# EAGLE board 26-de-8 (EAGLE 6.6.0), part 1 of 4
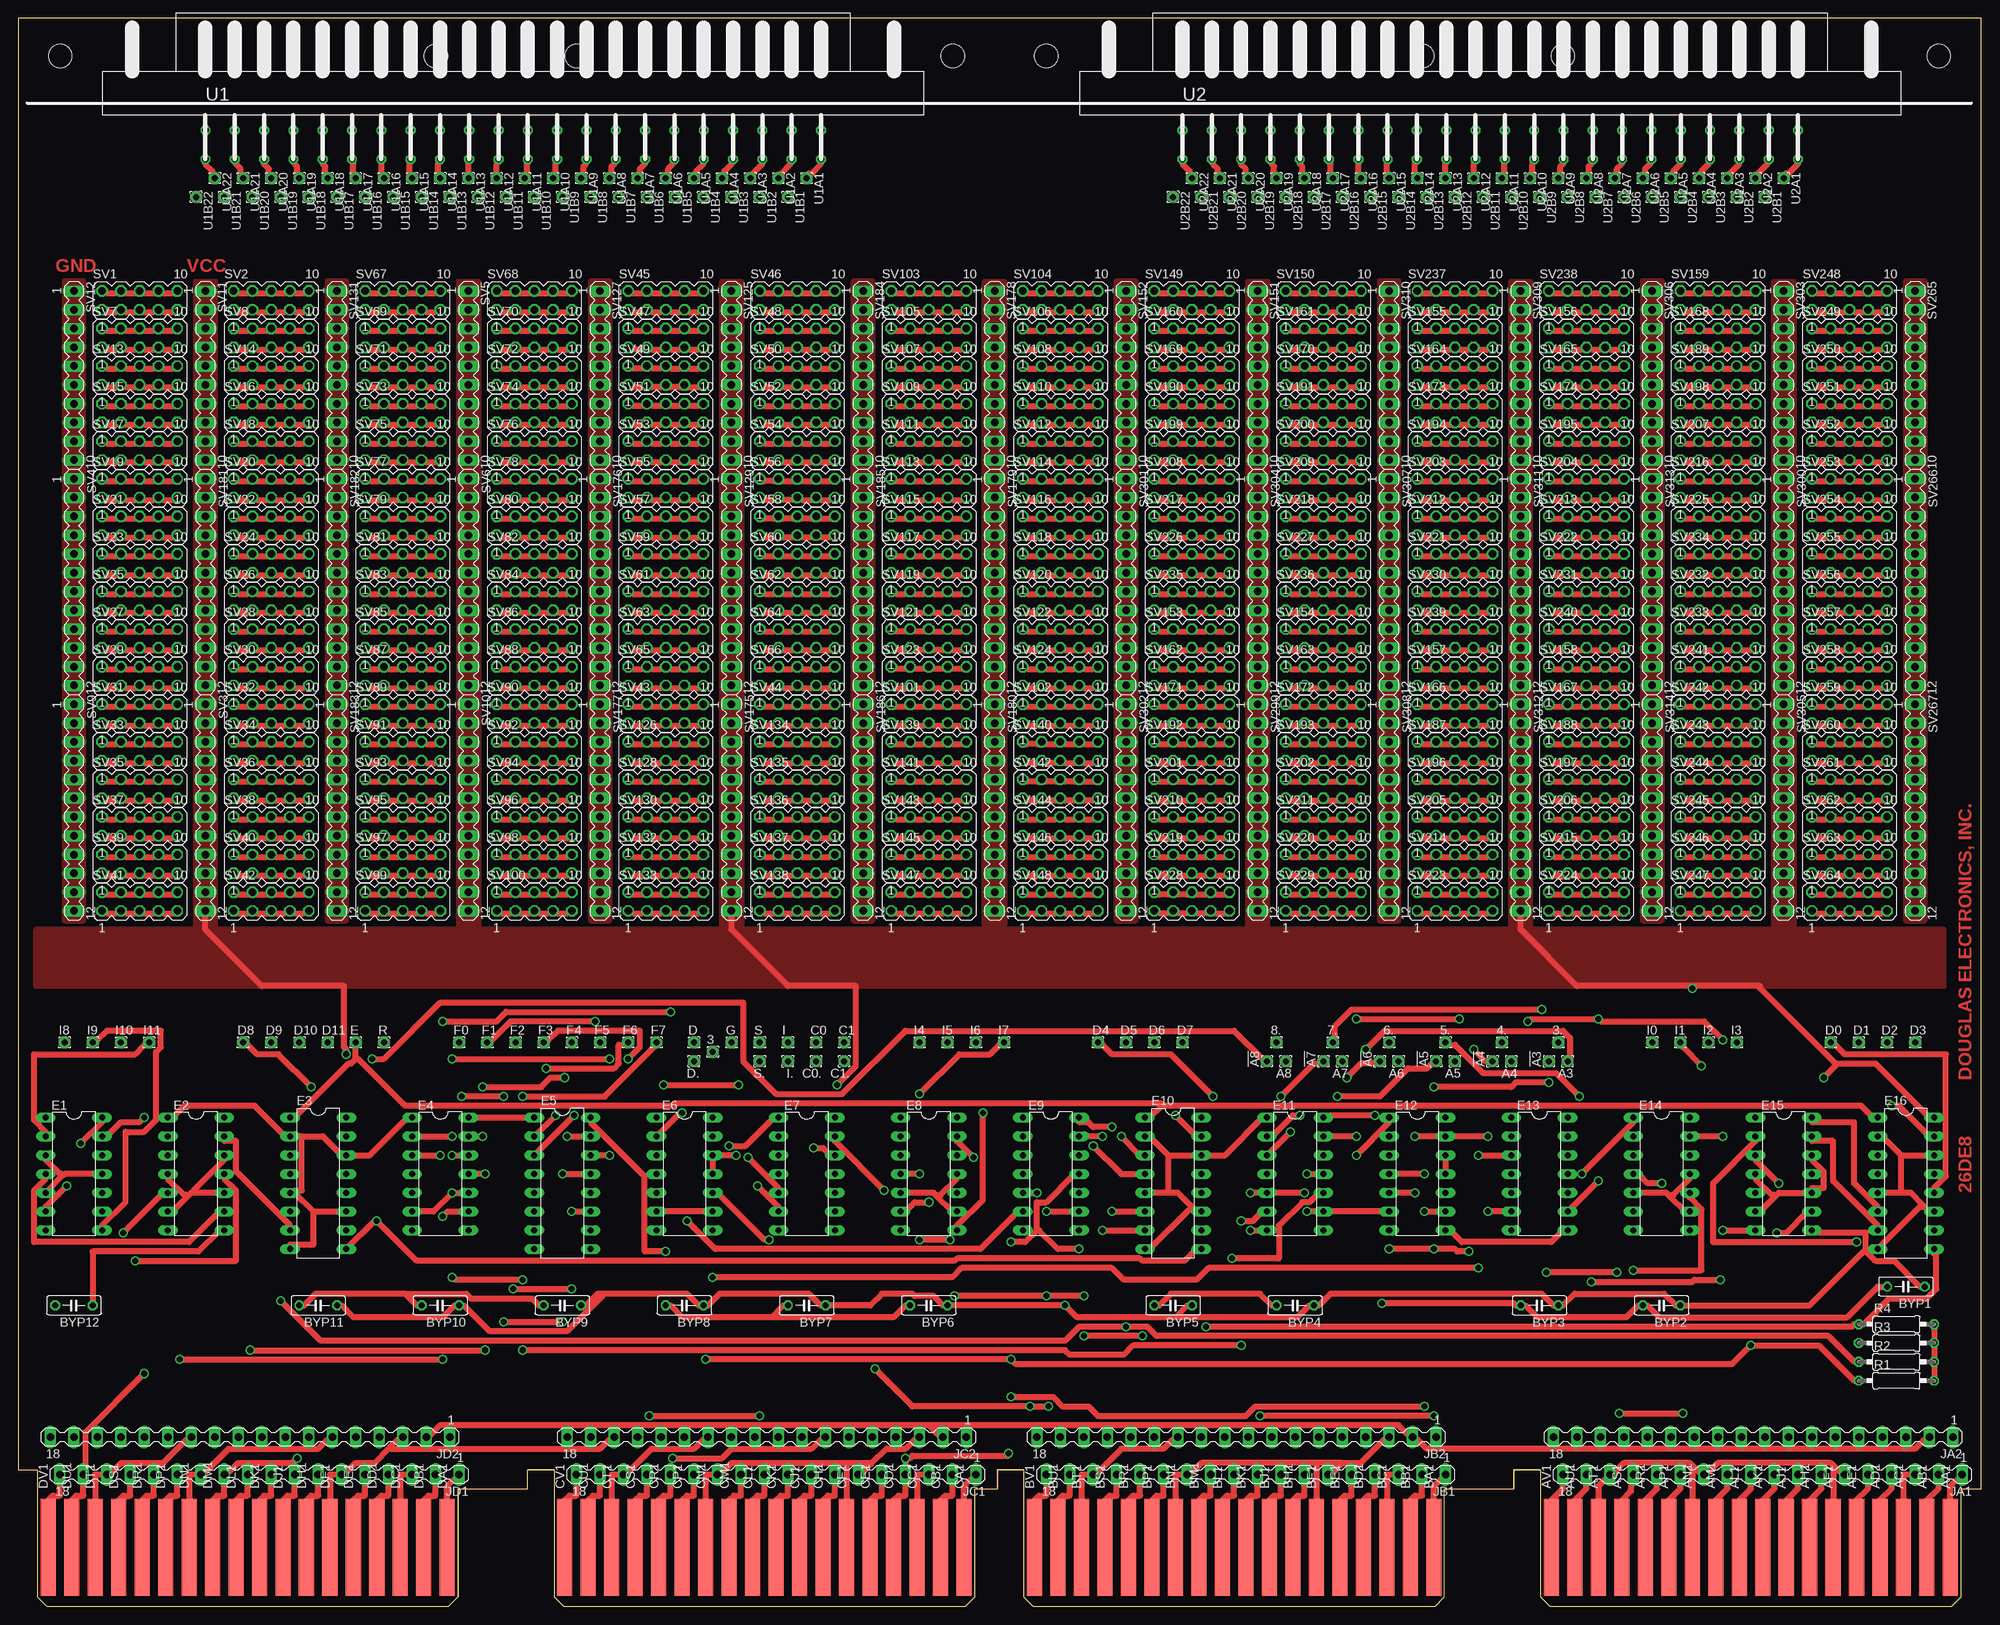
[diagram p4: board, top side]
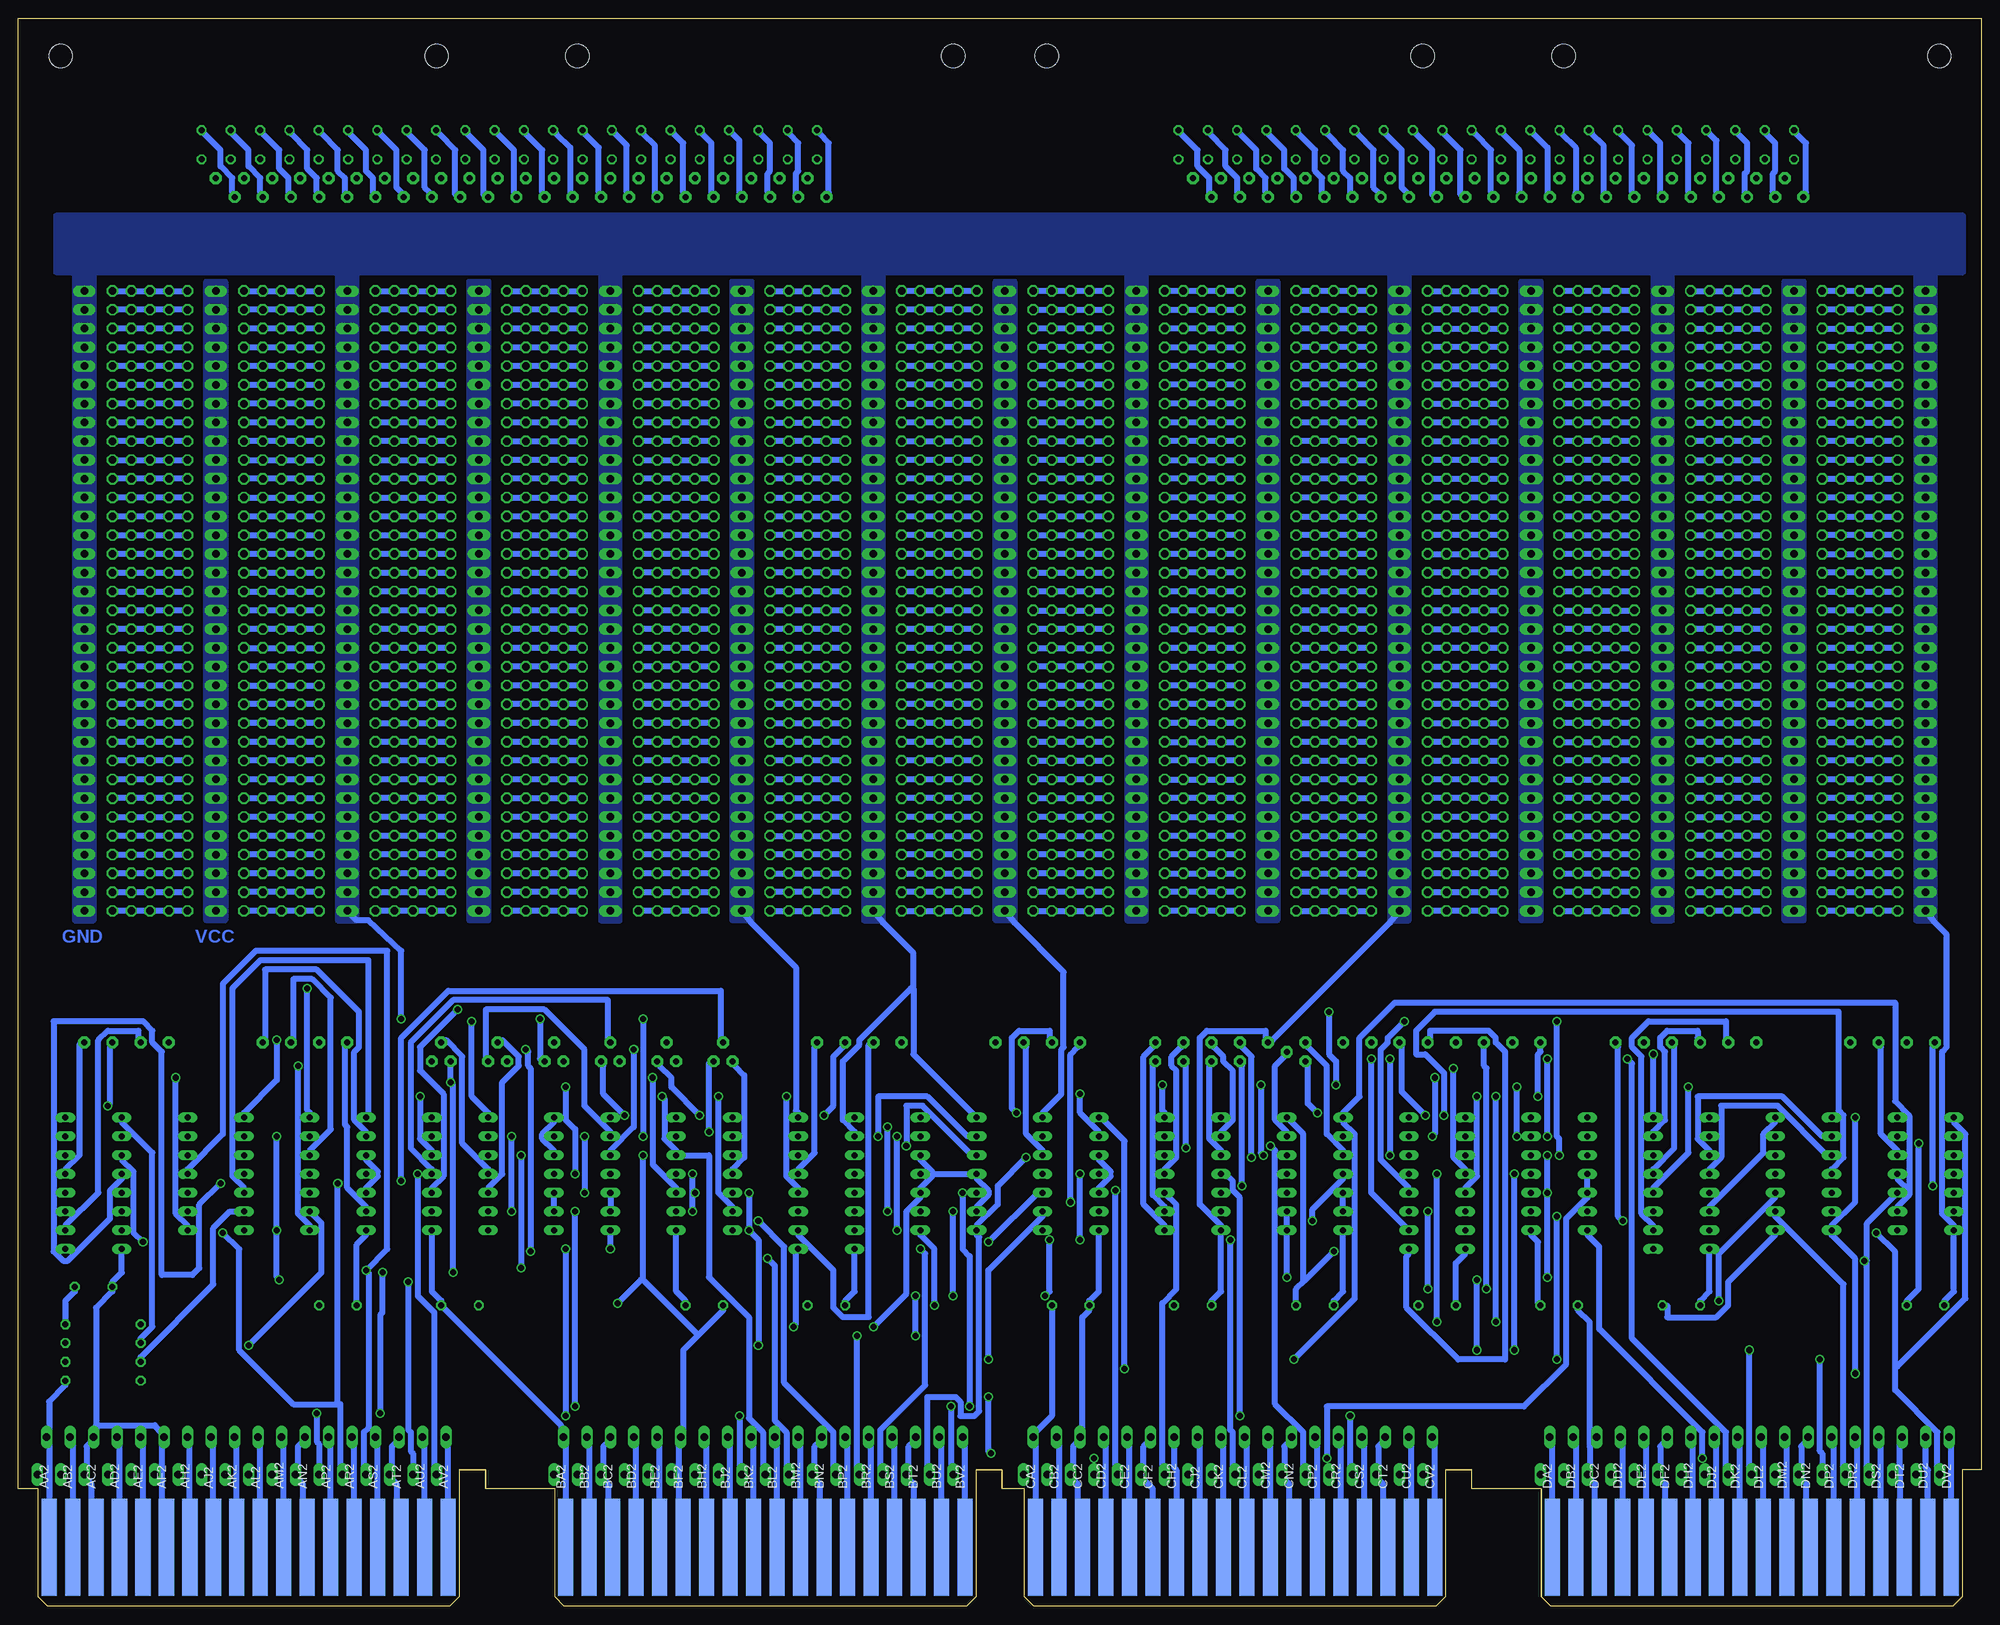
[diagram p5: board, bottom side, seen from below]

Size 265.3 x 214.63 mm. Coordinates in mm from the lower left corner, seen from the top.
Copper layers (1+16): Top 0.035mm / dielectric 1.5mm / Bottom 0.035mm
Design rules "16mils": minimum track width 16mil, minimum drill 32mil, track to track 15mil, track to pad 10mil, pad to pad 10mil, via to via 10mil, smd to smd 10mil, copper to edge 13mil, drill to drill 10mil, minimum pad ring 10mil, minimum via ring 8mil, stop-mask expansion 0mil, vias tented up to drill 0mil, thermal gap 10mil
Net classes: 0 default: width 0.813 mm; 1 supply: width 0.813 mm

## Footprints (pad centres in the part's own frame; a part is rotated, then mirrored left to right if it is on the bottom)
1,6/0,8 = drill 0.813 pad 1.6 octagon: 1 0,0
C050-025X075 = drill 0.813 octagon: 1 -2.54,0; 2 2.54,0
DIL14 = drill 0.813 long: 1 -7.62,-3.81; 2 -5.08,-3.81; 3 -2.54,-3.81; 4 0,-3.81; 5 2.54,-3.81; 6 5.08,-3.81; 7 7.62,-3.81; 8 7.62,3.81; 9 5.08,3.81; 10 2.54,3.81; 11 0,3.81; 12 -2.54,3.81; 13 -5.08,3.81; 14 -7.62,3.81
DIL16 = drill 0.813 long: 1 -8.89,-3.81; 2 -6.35,-3.81; 3 -3.81,-3.81; 4 -1.27,-3.81; 5 1.27,-3.81; 6 3.81,-3.81; 7 6.35,-3.81; 8 8.89,-3.81; 9 8.89,3.81; 10 6.35,3.81; 11 3.81,3.81; 12 1.27,3.81; 13 -1.27,3.81; 14 -3.81,3.81; 15 -6.35,3.81; 16 -8.89,3.81
MA18-1 = drill 1.016 long: 1 -25.4,0; 2 -22.225,0; 3 -19.05,0; 4 -15.875,0; 5 -12.7,0; 6 -9.525,0; 7 -6.35,0; 8 -3.175,0; 9 0,0; 10 3.175,0; 11 6.35,0; 12 9.525,0; 13 12.7,0; 14 15.875,0; 15 19.05,0; 16 22.225,0; 17 25.4,0; 18 28.575,0
0207/10 = drill 0.813 octagon: 1 -5.08,0; 2 5.08,0
MA05-2 = drill 1.016 octagon: 1 -5.08,-1.27; 2 -5.08,1.27; 3 -2.54,-1.27; 4 -2.54,1.27; 5 0,-1.27; 6 0,1.27; 7 2.54,-1.27; 8 2.54,1.27; 9 5.08,-1.27; 10 5.08,1.27
MA12-1 = drill 1.016 long: 1 -13.97,0; 2 -11.43,0; 3 -8.89,0; 4 -6.35,0; 5 -3.81,0; 6 -1.27,0; 7 1.27,0; 8 3.81,0; 9 6.35,0; 10 8.89,0; 11 11.43,0; 12 13.97,0
MA10-1 = drill 1.016 long: 1 -11.43,0; 2 -8.89,0; 3 -6.35,0; 4 -3.81,0; 5 -1.27,0; 6 1.27,0; 7 3.81,0; 8 6.35,0; 9 8.89,0; 10 11.43,0
133-022-03 = drill 0.813 octagon: A1 83.21,0; A2 83.21,3.962; B1 79.248,0; B2 79.248,3.962; C1 75.286,0; C2 75.286,3.962; D1 71.323,0; D2 71.323,3.962; E1 67.361,0; E2 67.361,3.962; F1 63.398,0; F2 63.398,3.962; H1 59.436,0; H2 59.436,3.962; J1 55.474,0; J2 55.474,3.962; K1 51.511,0; K2 51.511,3.962; L1 47.549,0; L2 47.549,3.962; M1 43.586,0; M2 43.586,3.962; N1 39.624,0; N2 39.624,3.962; P1 35.662,0; P2 35.662,3.962; R1 31.699,0; R2 31.699,3.962; S1 27.737,0; S2 27.737,3.962; T1 23.774,0; T2 23.774,3.962; U1 19.812,0; U2 19.812,3.962; V1 15.85,0; V2 15.85,3.962; W1 11.887,0; W2 11.887,3.962; X1 7.925,0; X2 7.925,3.962; Y1 3.962,0; Y2 3.962,3.962; Z1 0,0; Z2 0,3.962
OMNIBUS = hole 3.175: 208.915,209.55; 259.715,209.55; 189.865,209.55; 139.065,209.55; 75.616,209.55; 126.416,209.55; 56.566,209.55; 5.766,209.55
EDGE-CON8 = smd 2.032 x 13.106: AA1 261.303,7.938; AB1 258.127,7.938; AC1 254.952,7.938; AD1 251.778,7.938; AE1 248.602,7.938; AF1 245.428,7.938; AH1 242.252,7.938; AJ1 239.077,7.938; AK1 235.903,7.938; AL1 232.727,7.938; AM1 229.553,7.938; AN1 226.377,7.938; AP1 223.202,7.938; AR1 220.028,7.938; AS1 216.852,7.938; AT1 213.678,7.938; AU1 210.502,7.938; AV1 207.327,7.938; BA1 191.452,7.938; BB1 188.278,7.938; BC1 185.102,7.938; BD1 181.928,7.938; BE1 178.752,7.938; BF1 175.577,7.938; BH1 172.403,7.938; BJ1 169.227,7.938; BK1 166.053,7.938; BL1 162.877,7.938; BM1 159.702,7.938; BN1 156.528,7.938; BP1 153.352,7.938; BR1 150.178,7.938; BS1 147.002,7.938; BT1 143.827,7.938; BU1 140.653,7.938; BV1 137.477,7.938; CA1 127.953,7.938; CB1 124.778,7.938; CC1 121.603,7.938; CD1 118.427,7.938; CE1 115.252,7.938; CF1 112.078,7.938; CH1 108.903,7.938; CJ1 105.728,7.938; CK1 102.552,7.938; CL1 99.377,7.938; CM1 96.203,7.938; CN1 93.028,7.938; CP1 89.853,7.938; CR1 86.677,7.938; CS1 83.502,7.938; CT1 80.328,7.938; CU1 77.153,7.938; CV1 73.978,7.938; DA1 58.102,7.938; DB1 54.928,7.938; DC1 51.752,7.938; DD1 48.578,7.938; DE1 45.403,7.938; DF1 42.227,7.938; DH1 39.053,7.938; DJ1 35.877,7.938; DK1 32.703,7.938; DL1 29.527,7.938; DM1 26.352,7.938; DN1 23.177,7.938; DP1 20.003,7.938; DR1 16.828,7.938; DS1 13.652,7.938; DT1 10.477,7.938; DU1 7.303,7.938; DV1 4.128,7.938 | smd 2.032 x 13.106 bottom: AA2 261.303,7.938; AB2 258.127,7.938; AC2 254.952,7.938; AD2 251.778,7.938; AE2 248.602,7.938; AF2 245.428,7.938; AH2 242.252,7.938; AJ2 239.077,7.938; AK2 235.903,7.938; AL2 232.727,7.938; AM2 229.553,7.938; AN2 226.377,7.938; AP2 223.202,7.938; AR2 220.028,7.938; AS2 216.852,7.938; AT2 213.678,7.938; AU2 210.502,7.938; AV2 207.327,7.938; BA2 191.452,7.938; BB2 188.278,7.938; BC2 185.102,7.938; BD2 181.928,7.938; BE2 178.752,7.938; BF2 175.577,7.938; BH2 172.403,7.938; BJ2 169.227,7.938; BK2 166.053,7.938; BL2 162.877,7.938; BM2 159.702,7.938; BN2 156.528,7.938; BP2 153.352,7.938; BR2 150.178,7.938; BS2 147.002,7.938; BT2 143.827,7.938; BU2 140.653,7.938; BV2 137.477,7.938; CA2 127.953,7.938; CB2 124.778,7.938; CC2 121.603,7.938; CD2 118.427,7.938; CE2 115.252,7.938; CF2 112.078,7.938; CH2 108.903,7.938; CJ2 105.728,7.938; CK2 102.552,7.938; CL2 99.377,7.938; CM2 96.203,7.938; CN2 93.028,7.938; CP2 89.853,7.938; CR2 86.677,7.938; CS2 83.502,7.938; CT2 80.328,7.938; CU2 77.153,7.938; CV2 73.978,7.938; DA2 58.102,7.938; DB2 54.928,7.938; DC2 51.752,7.938; DD2 48.578,7.938; DE2 45.403,7.938; DF2 42.227,7.938; DH2 39.053,7.938; DJ2 35.877,7.938; DK2 32.703,7.938; DL2 29.527,7.938; DM2 26.352,7.938; DN2 23.177,7.938; DP2 20.003,7.938; DR2 16.828,7.938; DS2 13.652,7.938; DT2 10.477,7.938; DU2 7.303,7.938; DV2 4.128,7.938

## Placement (x,y rotation side)
3  [1,6/0,8]  93.85,74.93 0 top
3.  [1,6/0,8]  208.15,76.2 0 top
4.  [1,6/0,8]  200.53,76.2 0 top
5.  [1,6/0,8]  192.91,76.2 0 top
6.  [1,6/0,8]  185.29,76.2 0 top
7.  [1,6/0,8]  177.67,76.2 0 top
8.  [1,6/0,8]  170.05,76.2 0 top
!A3  [1,6/0,8]  206.88,73.66 90 top
!A4  [1,6/0,8]  199.26,73.66 90 top
!A5  [1,6/0,8]  191.64,73.66 90 top
!A6  [1,6/0,8]  184.02,73.66 90 top
!A7  [1,6/0,8]  176.4,73.66 90 top
!A8  [1,6/0,8]  168.78,73.66 90 top
A3  [1,6/0,8]  209.42,73.66 180 top
A4  [1,6/0,8]  201.8,73.66 180 top
A5  [1,6/0,8]  194.18,73.66 180 top
A6  [1,6/0,8]  186.56,73.66 180 top
A7  [1,6/0,8]  178.94,73.66 180 top
A8  [1,6/0,8]  171.32,73.66 180 top
BYP1  0.1uF  [C050-025X075]  255.14,43.18 180 top
BYP2  0.1uF  [C050-025X075]  222.12,40.64 180 top
BYP3  0.1uF  [C050-025X075]  205.61,40.64 180 top
BYP4  0.1uF  [C050-025X075]  172.59,40.64 180 top
BYP5  0.1uF  [C050-025X075]  156.08,40.64 180 top
BYP6  0.1uF  [C050-025X075]  123.06,40.64 180 top
BYP7  0.1uF  [C050-025X075]  106.55,40.64 180 top
BYP8  0.1uF  [C050-025X075]  90.04,40.64 180 top
BYP9  0.1uF  [C050-025X075]  73.53,40.64 180 top
BYP10  0.1uF  [C050-025X075]  57.02,40.64 180 top
BYP11  0.1uF  [C050-025X075]  40.51,40.64 180 top
BYP12  0.1uF  [C050-025X075]  7.49,40.64 180 top
C0  [1,6/0,8]  107.82,76.2 0 top
C0.  [1,6/0,8]  107.82,73.66 180 top
C1  [1,6/0,8]  111.63,76.2 0 top
C1.  [1,6/0,8]  111.63,73.66 180 top
D  [1,6/0,8]  91.31,76.2 0 top
D0  [1,6/0,8]  244.98,76.2 0 top
D1  [1,6/0,8]  248.79,76.2 0 top
D2  [1,6/0,8]  252.6,76.2 0 top
D3  [1,6/0,8]  256.41,76.2 0 top
D4  [1,6/0,8]  145.92,76.2 0 top
D5  [1,6/0,8]  149.73,76.2 0 top
D6  [1,6/0,8]  153.54,76.2 0 top
D7  [1,6/0,8]  157.35,76.2 0 top
D8  [1,6/0,8]  30.35,76.2 0 top
D9  [1,6/0,8]  34.16,76.2 0 top
D10  [1,6/0,8]  37.97,76.2 0 top
D11  [1,6/0,8]  41.78,76.2 0 top
D.  [1,6/0,8]  91.31,73.66 180 top
E  [1,6/0,8]  45.59,76.2 0 top
E1  N8881N  [DIL14]  7.49,58.42 270 top
E2  SP380N  [DIL14]  24,58.42 270 top
E3  DM9314  [DIL16]  40.51,57.15 270 top
E4  SP380N  [DIL14]  57.02,58.42 270 top
E5  DEC8251  [DIL16]  73.53,57.15 270 top
E6  N8881N  [DIL14]  90.04,58.42 270 top
E7  N8881N  [DIL14]  106.55,58.42 270 top
E8  N8881N  [DIL14]  123.06,58.42 270 top
E9  SP380N  [DIL14]  139.57,58.42 270 top
E10  DM9314  [DIL16]  156.08,57.15 270 top
E11  SP380N  [DIL14]  172.59,58.42 270 top
E12  SP380N  [DIL14]  189.1,58.42 270 top
E13  SP314N  [DIL14]  205.61,58.42 270 top
E14  N8881N  [DIL14]  222.12,58.42 270 top
E15  SP380N  [DIL14]  238.63,58.42 270 top
E16  DM9314  [DIL16]  255.14,57.15 270 top
F0  [1,6/0,8]  59.56,76.2 0 top
F1  [1,6/0,8]  63.37,76.2 0 top
F2  [1,6/0,8]  67.18,76.2 0 top
F3  [1,6/0,8]  70.99,76.2 0 top
F4  [1,6/0,8]  74.8,76.2 0 top
F5  [1,6/0,8]  78.61,76.2 0 top
F6  [1,6/0,8]  82.42,76.2 0 top
F7  [1,6/0,8]  86.23,76.2 0 top
G  [1,6/0,8]  96.39,76.2 0 top
I  [1,6/0,8]  104.01,76.2 0 top
I0  [1,6/0,8]  220.85,76.2 0 top
I1  [1,6/0,8]  224.66,76.2 0 top
I2  [1,6/0,8]  228.47,76.2 0 top
I3  [1,6/0,8]  232.28,76.2 0 top
I4  [1,6/0,8]  121.79,76.2 0 top
I5  [1,6/0,8]  125.6,76.2 0 top
I6  [1,6/0,8]  129.41,76.2 0 top
I7  [1,6/0,8]  133.22,76.2 0 top
I8  [1,6/0,8]  6.22,76.2 0 top
I9  [1,6/0,8]  10.03,76.2 0 top
I10  [1,6/0,8]  13.84,76.2 0 top
I11  [1,6/0,8]  17.65,76.2 0 top
I.  [1,6/0,8]  104.01,73.66 180 top
JA1  MA18-1  [MA18-1]  237.36,17.78 180 top
JA2  MA18-1  [MA18-1]  236.09,22.86 180 top
JB1  MA18-1  [MA18-1]  167.51,17.78 180 top
JB2  MA18-1  [MA18-1]  166.24,22.86 180 top
JC1  MA18-1  [MA18-1]  104.01,17.78 180 top
JC2  MA18-1  [MA18-1]  102.74,22.86 180 top
JD1  MA18-1  [MA18-1]  34.16,17.78 180 top
JD2  MA18-1  [MA18-1]  32.89,22.86 180 top
R  [1,6/0,8]  49.4,76.2 0 top
R1  [0207/10]  253.87,30.48 0 top
R2  [0207/10]  253.87,33.02 0 top
R3  [0207/10]  253.87,35.56 0 top
R4  [0207/10]  253.87,38.1 0 top
S  [1,6/0,8]  100.2,76.2 0 top
S.  [1,6/0,8]  100.2,73.66 180 top
SV1  [MA05-2]  16.38,176.53 0 top
SV2  [MA05-2]  34.16,176.53 0 top
SV3  [MA12-1]  25.27,107.95 270 top
SV4  [MA12-1]  7.49,138.43 270 top
SV5  [MA10-1]  60.83,166.37 270 top
SV6  [MA12-1]  60.83,138.43 270 top
SV7  [MA05-2]  16.38,171.45 0 top
SV8  [MA05-2]  34.16,171.45 0 top
SV9  [MA12-1]  7.49,107.95 270 top
SV10  [MA12-1]  60.83,107.95 270 top
SV11  [MA10-1]  25.27,166.37 270 top
SV12  [MA10-1]  7.49,166.37 270 top
SV13  [MA05-2]  16.38,166.37 0 top
SV14  [MA05-2]  34.16,166.37 0 top
SV15  [MA05-2]  16.38,161.29 0 top
SV16  [MA05-2]  34.16,161.29 0 top
SV17  [MA05-2]  16.38,156.21 0 top
SV18  [MA05-2]  34.16,156.21 0 top
SV19  [MA05-2]  16.38,151.13 0 top
SV20  [MA05-2]  34.16,151.13 0 top
SV21  [MA05-2]  16.38,146.05 0 top
SV22  [MA05-2]  34.16,146.05 0 top
SV23  [MA05-2]  16.38,140.97 0 top
SV24  [MA05-2]  34.16,140.97 0 top
SV25  [MA05-2]  16.38,135.89 0 top
SV26  [MA05-2]  34.16,135.89 0 top
SV27  [MA05-2]  16.38,130.81 0 top
SV28  [MA05-2]  34.16,130.81 0 top
SV29  [MA05-2]  16.38,125.73 0 top
SV30  [MA05-2]  34.16,125.73 0 top
SV31  [MA05-2]  16.38,120.65 0 top
SV32  [MA05-2]  34.16,120.65 0 top
SV33  [MA05-2]  16.38,115.57 0 top
SV34  [MA05-2]  34.16,115.57 0 top
SV35  [MA05-2]  16.38,110.49 0 top
SV36  [MA05-2]  34.16,110.49 0 top
SV37  [MA05-2]  16.38,105.41 0 top
SV38  [MA05-2]  34.16,105.41 0 top
SV39  [MA05-2]  16.38,100.33 0 top
SV40  [MA05-2]  34.16,100.33 0 top
SV41  [MA05-2]  16.38,95.25 0 top
SV42  [MA05-2]  34.16,95.25 0 top
SV43  [MA05-2]  87.5,120.65 0 top
SV44  [MA05-2]  105.28,120.65 0 top
SV45  [MA05-2]  87.5,176.53 0 top
SV46  [MA05-2]  105.28,176.53 0 top
SV47  [MA05-2]  87.5,171.45 0 top
SV48  [MA05-2]  105.28,171.45 0 top
SV49  [MA05-2]  87.5,166.37 0 top
SV50  [MA05-2]  105.28,166.37 0 top
SV51  [MA05-2]  87.5,161.29 0 top
SV52  [MA05-2]  105.28,161.29 0 top
SV53  [MA05-2]  87.5,156.21 0 top
SV54  [MA05-2]  105.28,156.21 0 top
SV55  [MA05-2]  87.5,151.13 0 top
SV56  [MA05-2]  105.28,151.13 0 top
SV57  [MA05-2]  87.5,146.05 0 top
SV58  [MA05-2]  105.28,146.05 0 top
SV59  [MA05-2]  87.5,140.97 0 top
SV60  [MA05-2]  105.28,140.97 0 top
SV61  [MA05-2]  87.5,135.89 0 top
SV62  [MA05-2]  105.28,135.89 0 top
SV63  [MA05-2]  87.5,130.81 0 top
SV64  [MA05-2]  105.28,130.81 0 top
SV65  [MA05-2]  87.5,125.73 0 top
SV66  [MA05-2]  105.28,125.73 0 top
SV67  [MA05-2]  51.94,176.53 0 top
SV68  [MA05-2]  69.72,176.53 0 top
SV69  [MA05-2]  51.94,171.45 0 top
SV70  [MA05-2]  69.72,171.45 0 top
SV71  [MA05-2]  51.94,166.37 0 top
SV72  [MA05-2]  69.72,166.37 0 top
SV73  [MA05-2]  51.94,161.29 0 top
SV74  [MA05-2]  69.72,161.29 0 top
SV75  [MA05-2]  51.94,156.21 0 top
SV76  [MA05-2]  69.72,156.21 0 top
SV77  [MA05-2]  51.94,151.13 0 top
SV78  [MA05-2]  69.72,151.13 0 top
SV79  [MA05-2]  51.94,146.05 0 top
SV80  [MA05-2]  69.72,146.05 0 top
SV81  [MA05-2]  51.94,140.97 0 top
SV82  [MA05-2]  69.72,140.97 0 top
SV83  [MA05-2]  51.94,135.89 0 top
SV84  [MA05-2]  69.72,135.89 0 top
SV85  [MA05-2]  51.94,130.81 0 top
SV86  [MA05-2]  69.72,130.81 0 top
SV87  [MA05-2]  51.94,125.73 0 top
SV88  [MA05-2]  69.72,125.73 0 top
SV89  [MA05-2]  51.94,120.65 0 top
SV90  [MA05-2]  69.72,120.65 0 top
SV91  [MA05-2]  51.94,115.57 0 top
SV92  [MA05-2]  69.72,115.57 0 top
SV93  [MA05-2]  51.94,110.49 0 top
SV94  [MA05-2]  69.72,110.49 0 top
SV95  [MA05-2]  51.94,105.41 0 top
SV96  [MA05-2]  69.72,105.41 0 top
SV97  [MA05-2]  51.94,100.33 0 top
SV98  [MA05-2]  69.72,100.33 0 top
SV99  [MA05-2]  51.94,95.25 0 top
SV100  [MA05-2]  69.72,95.25 0 top
SV101  [MA05-2]  123.06,120.65 0 top
SV102  [MA05-2]  140.84,120.65 0 top
SV103  [MA05-2]  123.06,176.53 0 top
SV104  [MA05-2]  140.84,176.53 0 top
SV105  [MA05-2]  123.06,171.45 0 top
SV106  [MA05-2]  140.84,171.45 0 top
SV107  [MA05-2]  123.06,166.37 0 top
SV108  [MA05-2]  140.84,166.37 0 top
SV109  [MA05-2]  123.06,161.29 0 top
SV110  [MA05-2]  140.84,161.29 0 top
SV111  [MA05-2]  123.06,156.21 0 top
SV112  [MA05-2]  140.84,156.21 0 top
SV113  [MA05-2]  123.06,151.13 0 top
SV114  [MA05-2]  140.84,151.13 0 top
SV115  [MA05-2]  123.06,146.05 0 top
SV116  [MA05-2]  140.84,146.05 0 top
SV117  [MA05-2]  123.06,140.97 0 top
SV118  [MA05-2]  140.84,140.97 0 top
SV119  [MA05-2]  123.06,135.89 0 top
SV120  [MA05-2]  140.84,135.89 0 top
SV121  [MA05-2]  123.06,130.81 0 top
SV122  [MA05-2]  140.84,130.81 0 top
SV123  [MA05-2]  123.06,125.73 0 top
SV124  [MA05-2]  140.84,125.73 0 top
SV125  [MA10-1]  96.39,166.37 270 top
SV126  [MA05-2]  87.5,115.57 0 top
SV127  [MA10-1]  78.61,166.37 270 top
SV128  [MA05-2]  87.5,110.49 0 top
SV129  [MA12-1]  96.39,138.43 270 top
SV130  [MA05-2]  87.5,105.41 0 top
SV131  [MA10-1]  43.05,166.37 270 top
SV132  [MA05-2]  87.5,100.33 0 top
SV133  [MA05-2]  87.5,95.25 0 top
SV134  [MA05-2]  105.28,115.57 0 top
SV135  [MA05-2]  105.28,110.49 0 top
SV136  [MA05-2]  105.28,105.41 0 top
SV137  [MA05-2]  105.28,100.33 0 top
SV138  [MA05-2]  105.28,95.25 0 top
SV139  [MA05-2]  123.06,115.57 0 top
SV140  [MA05-2]  140.84,115.57 0 top
SV141  [MA05-2]  123.06,110.49 0 top
SV142  [MA05-2]  140.84,110.49 0 top
SV143  [MA05-2]  123.06,105.41 0 top
SV144  [MA05-2]  140.84,105.41 0 top
SV145  [MA05-2]  123.06,100.33 0 top
SV146  [MA05-2]  140.84,100.33 0 top
SV147  [MA05-2]  123.06,95.25 0 top
SV148  [MA05-2]  140.84,95.25 0 top
SV149  [MA05-2]  158.62,176.53 0 top
SV150  [MA05-2]  176.4,176.53 0 top
SV151  [MA10-1]  167.51,166.37 270 top
SV152  [MA10-1]  149.73,166.37 270 top
SV153  [MA05-2]  158.62,130.81 0 top
SV154  [MA05-2]  176.4,130.81 0 top
SV155  [MA05-2]  194.18,171.45 0 top
SV156  [MA05-2]  211.96,171.45 0 top
SV157  [MA05-2]  194.18,125.73 0 top
SV158  [MA05-2]  211.96,125.73 0 top
SV159  [MA05-2]  229.74,176.53 0 top
SV160  [MA05-2]  158.62,171.45 0 top
SV161  [MA05-2]  176.4,171.45 0 top
SV162  [MA05-2]  158.62,125.73 0 top
SV163  [MA05-2]  176.4,125.73 0 top
SV164  [MA05-2]  194.18,166.37 0 top
SV165  [MA05-2]  211.96,166.37 0 top
SV166  [MA05-2]  194.18,120.65 0 top
SV167  [MA05-2]  211.96,120.65 0 top
SV168  [MA05-2]  229.74,171.45 0 top
SV169  [MA05-2]  158.62,166.37 0 top
SV170  [MA05-2]  176.4,166.37 0 top
SV171  [MA05-2]  158.62,120.65 0 top
SV172  [MA05-2]  176.4,120.65 0 top
SV173  [MA05-2]  194.18,161.29 0 top
SV174  [MA05-2]  211.96,161.29 0 top
SV175  [MA12-1]  96.39,107.95 270 top
SV176  [MA12-1]  78.61,138.43 270 top
SV177  [MA12-1]  78.61,107.95 270 top
SV178  [MA10-1]  131.95,166.37 270 top
SV179  [MA12-1]  131.95,138.43 270 top
SV180  [MA12-1]  131.95,107.95 270 top
SV181  [MA12-1]  25.27,138.43 270 top
SV182  [MA12-1]  43.05,138.43 270 top
SV183  [MA12-1]  43.05,107.95 270 top
SV184  [MA10-1]  114.17,166.37 270 top
SV185  [MA12-1]  114.17,138.43 270 top
SV186  [MA12-1]  114.17,107.95 270 top
SV187  [MA05-2]  194.18,115.57 0 top
SV188  [MA05-2]  211.96,115.57 0 top
SV189  [MA05-2]  229.74,166.37 0 top
SV190  [MA05-2]  158.62,161.29 0 top
SV191  [MA05-2]  176.4,161.29 0 top
SV192  [MA05-2]  158.62,115.57 0 top
SV193  [MA05-2]  176.4,115.57 0 top
SV194  [MA05-2]  194.18,156.21 0 top
SV195  [MA05-2]  211.96,156.21 0 top
SV196  [MA05-2]  194.18,110.49 0 top
SV197  [MA05-2]  211.96,110.49 0 top
SV198  [MA05-2]  229.74,161.29 0 top
SV199  [MA05-2]  158.62,156.21 0 top
SV200  [MA05-2]  176.4,156.21 0 top
SV201  [MA05-2]  158.62,110.49 0 top
SV202  [MA05-2]  176.4,110.49 0 top
SV203  [MA05-2]  194.18,151.13 0 top
SV204  [MA05-2]  211.96,151.13 0 top
SV205  [MA05-2]  194.18,105.41 0 top
SV206  [MA05-2]  211.96,105.41 0 top
SV207  [MA05-2]  229.74,156.21 0 top
SV208  [MA05-2]  158.62,151.13 0 top
SV209  [MA05-2]  176.4,151.13 0 top
SV210  [MA05-2]  158.62,105.41 0 top
SV211  [MA05-2]  176.4,105.41 0 top
SV212  [MA05-2]  194.18,146.05 0 top
SV213  [MA05-2]  211.96,146.05 0 top
SV214  [MA05-2]  194.18,100.33 0 top
SV215  [MA05-2]  211.96,100.33 0 top
SV216  [MA05-2]  229.74,151.13 0 top
SV217  [MA05-2]  158.62,146.05 0 top
SV218  [MA05-2]  176.4,146.05 0 top
SV219  [MA05-2]  158.62,100.33 0 top
SV220  [MA05-2]  176.4,100.33 0 top
SV221  [MA05-2]  194.18,140.97 0 top
SV222  [MA05-2]  211.96,140.97 0 top
SV223  [MA05-2]  194.18,95.25 0 top
SV224  [MA05-2]  211.96,95.25 0 top
SV225  [MA05-2]  229.74,146.05 0 top
SV226  [MA05-2]  158.62,140.97 0 top
SV227  [MA05-2]  176.4,140.97 0 top
SV228  [MA05-2]  158.62,95.25 0 top
SV229  [MA05-2]  176.4,95.25 0 top
SV230  [MA05-2]  194.18,135.89 0 top
SV231  [MA05-2]  211.96,135.89 0 top
SV232  [MA05-2]  229.74,135.89 0 top
SV233  [MA05-2]  229.74,130.81 0 top
SV234  [MA05-2]  229.74,140.97 0 top
SV235  [MA05-2]  158.62,135.89 0 top
SV236  [MA05-2]  176.4,135.89 0 top
SV237  [MA05-2]  194.18,176.53 0 top
SV238  [MA05-2]  211.96,176.53 0 top
SV239  [MA05-2]  194.18,130.81 0 top
SV240  [MA05-2]  211.96,130.81 0 top
SV241  [MA05-2]  229.74,125.73 0 top
SV242  [MA05-2]  229.74,120.65 0 top
SV243  [MA05-2]  229.74,115.57 0 top
SV244  [MA05-2]  229.74,110.49 0 top
SV245  [MA05-2]  229.74,105.41 0 top
SV246  [MA05-2]  229.74,100.33 0 top
SV247  [MA05-2]  229.74,95.25 0 top
SV248  [MA05-2]  247.52,176.53 0 top
SV249  [MA05-2]  247.52,171.45 0 top
SV250  [MA05-2]  247.52,166.37 0 top
SV251  [MA05-2]  247.52,161.29 0 top
SV252  [MA05-2]  247.52,156.21 0 top
SV253  [MA05-2]  247.52,151.13 0 top
SV254  [MA05-2]  247.52,146.05 0 top
SV255  [MA05-2]  247.52,140.97 0 top
SV256  [MA05-2]  247.52,135.89 0 top
SV257  [MA05-2]  247.52,130.81 0 top
SV258  [MA05-2]  247.52,125.73 0 top
SV259  [MA05-2]  247.52,120.65 0 top
SV260  [MA05-2]  247.52,115.57 0 top
SV261  [MA05-2]  247.52,110.49 0 top
SV262  [MA05-2]  247.52,105.41 0 top
SV263  [MA05-2]  247.52,100.33 0 top
SV264  [MA05-2]  247.52,95.25 0 top
SV265  [MA10-1]  256.41,166.37 270 top
SV266  [MA12-1]  256.41,138.43 270 top
SV267  [MA12-1]  256.41,107.95 270 top
SV299  [MA12-1]  167.51,107.95 270 top
SV300  [MA12-1]  238.63,138.43 270 top
SV301  [MA12-1]  149.73,138.43 270 top
SV302  [MA12-1]  149.73,107.95 270 top
SV303  [MA10-1]  238.63,166.37 270 top
SV304  [MA12-1]  167.51,138.43 270 top
SV305  [MA12-1]  238.63,107.95 270 top
SV306  [MA10-1]  220.85,166.37 270 top
SV307  [MA12-1]  185.29,138.43 270 top
SV308  [MA12-1]  185.29,107.95 270 top
SV309  [MA10-1]  203.07,166.37 270 top
SV310  [MA10-1]  185.29,166.37 270 top
SV311  [MA12-1]  203.07,138.43 270 top
SV312  [MA12-1]  203.07,107.95 270 top
SV313  [MA12-1]  220.85,138.43 270 top
SV314  [MA12-1]  220.85,107.95 270 top
U1  133-022-03  [133-022-03]  25.27,195.58 0 top
U1A1  [1,6/0,8]  106.55,193.04 270 top
U1A2  [1,6/0,8]  102.74,193.04 270 top
U1A3  [1,6/0,8]  98.93,193.04 270 top
U1A4  [1,6/0,8]  95.12,193.04 270 top
U1A5  [1,6/0,8]  91.31,193.04 270 top
U1A6  [1,6/0,8]  87.5,193.04 270 top
U1A7  [1,6/0,8]  83.69,193.04 270 top
U1A8  [1,6/0,8]  79.88,193.04 270 top
U1A9  [1,6/0,8]  76.07,193.04 270 top
U1A10  [1,6/0,8]  72.26,193.04 270 top
U1A11  [1,6/0,8]  68.45,193.04 270 top
U1A12  [1,6/0,8]  64.64,193.04 270 top
U1A13  [1,6/0,8]  60.83,193.04 270 top
U1A14  [1,6/0,8]  57.02,193.04 270 top
U1A15  [1,6/0,8]  53.21,193.04 270 top
U1A16  [1,6/0,8]  49.4,193.04 270 top
U1A17  [1,6/0,8]  45.59,193.04 270 top
U1A18  [1,6/0,8]  41.78,193.04 270 top
U1A19  [1,6/0,8]  37.97,193.04 270 top
U1A20  [1,6/0,8]  34.16,193.04 270 top
U1A21  [1,6/0,8]  30.35,193.04 270 top
U1A22  [1,6/0,8]  26.54,193.04 270 top
U1B1  [1,6/0,8]  104.01,190.5 270 top
U1B2  [1,6/0,8]  100.2,190.5 270 top
U1B3  [1,6/0,8]  96.39,190.5 270 top
U1B4  [1,6/0,8]  92.58,190.5 270 top
U1B5  [1,6/0,8]  88.77,190.5 270 top
U1B6  [1,6/0,8]  84.96,190.5 270 top
U1B7  [1,6/0,8]  81.15,190.5 270 top
U1B8  [1,6/0,8]  77.34,190.5 270 top
U1B9  [1,6/0,8]  73.53,190.5 270 top
U1B10  [1,6/0,8]  69.72,190.5 270 top
U1B11  [1,6/0,8]  65.91,190.5 270 top
U1B12  [1,6/0,8]  62.1,190.5 270 top
U1B13  [1,6/0,8]  58.29,190.5 270 top
U1B14  [1,6/0,8]  54.48,190.5 270 top
U1B15  [1,6/0,8]  50.67,190.5 270 top
U1B16  [1,6/0,8]  46.86,190.5 270 top
U1B17  [1,6/0,8]  43.05,190.5 270 top
U1B18  [1,6/0,8]  39.24,190.5 270 top
U1B19  [1,6/0,8]  35.43,190.5 270 top
U1B20  [1,6/0,8]  31.62,190.5 270 top
U1B21  [1,6/0,8]  27.81,190.5 270 top
U1B22  [1,6/0,8]  24,190.5 270 top
U2  133-022-03  [133-022-03]  157.35,195.58 0 top
U2A1  [1,6/0,8]  238.63,193.04 270 top
U2A2  [1,6/0,8]  234.82,193.04 270 top
U2A3  [1,6/0,8]  231.01,193.04 270 top
U2A4  [1,6/0,8]  227.2,193.04 270 top
U2A5  [1,6/0,8]  223.39,193.04 270 top
U2A6  [1,6/0,8]  219.58,193.04 270 top
U2A7  [1,6/0,8]  215.77,193.04 270 top
U2A8  [1,6/0,8]  211.96,193.04 270 top
U2A9  [1,6/0,8]  208.15,193.04 270 top
U2A10  [1,6/0,8]  204.34,193.04 270 top
U2A11  [1,6/0,8]  200.53,193.04 270 top
U2A12  [1,6/0,8]  196.72,193.04 270 top
U2A13  [1,6/0,8]  192.91,193.04 270 top
U2A14  [1,6/0,8]  189.1,193.04 270 top
U2A15  [1,6/0,8]  185.29,193.04 270 top
U2A16  [1,6/0,8]  181.48,193.04 270 top
U2A17  [1,6/0,8]  177.67,193.04 270 top
U2A18  [1,6/0,8]  173.86,193.04 270 top
U2A19  [1,6/0,8]  170.05,193.04 270 top
U2A20  [1,6/0,8]  166.24,193.04 270 top
U2A21  [1,6/0,8]  162.43,193.04 270 top
U2A22  [1,6/0,8]  158.62,193.04 270 top
U2B1  [1,6/0,8]  236.09,190.5 270 top
U2B2  [1,6/0,8]  232.28,190.5 270 top
U2B3  [1,6/0,8]  228.47,190.5 270 top
U2B4  [1,6/0,8]  224.66,190.5 270 top
U2B5  [1,6/0,8]  220.85,190.5 270 top
U2B6  [1,6/0,8]  217.04,190.5 270 top
U2B7  [1,6/0,8]  213.23,190.5 270 top
U2B8  [1,6/0,8]  209.42,190.5 270 top
U2B9  [1,6/0,8]  205.61,190.5 270 top
U2B10  [1,6/0,8]  201.8,190.5 270 top
U2B11  [1,6/0,8]  197.99,190.5 270 top
U2B12  [1,6/0,8]  194.18,190.5 270 top
U2B13  [1,6/0,8]  190.37,190.5 270 top
U2B14  [1,6/0,8]  186.56,190.5 270 top
U2B15  [1,6/0,8]  182.75,190.5 270 top
U2B16  [1,6/0,8]  178.94,190.5 270 top
U2B17  [1,6/0,8]  175.13,190.5 270 top
U2B18  [1,6/0,8]  171.32,190.5 270 top
U2B19  [1,6/0,8]  167.51,190.5 270 top
U2B20  [1,6/0,8]  163.7,190.5 270 top
U2B21  [1,6/0,8]  159.89,190.5 270 top
U2B22  [1,6/0,8]  156.08,190.5 270 top
U$1  OUTLINE-OMNIBUS  [OMNIBUS]  -0.13,0 0 top
U$2  [EDGE-CON8]  -0.13,0 0 top

## Tracks (layer width: path | path; a pad name or v marks a point on that pad's centre or on a via)
!BREAK_CYCLE
  Bottom 0.813: JB2.10 162.75,22.23 U$2.BL2
!BRK_DATA_CONT
  Bottom 0.813: JB2.9 165.93,22.23 U$2.BK2
!BRK_IN_PROG
  Bottom 0.813: JB2.5 178.62,22.23 U$2.BE2
!BUS_STROBE
  Top 0.813: JC1.9 104.01,14.92 103.06,14.92 102.43,14.29 U$2.CK1
!C0  (via drill 0.81)
  Top 0.813: v117.03,56.2 110.36,62.87 E7.13 | JC1.5 116.71,14.92 115.76,14.92 115.12,14.29 U$2.CE1
  Bottom 0.813: v117.03,56.2 117.03,18.1 JC1.5
!C1
  Top 0.813: JC1.7 110.36,14.92 109.41,14.92 108.78,14.29 U$2.CH1
  Bottom 0.813: E7.10 108.78,54.29 108.78,42.86 110.68,40.96 110.68,18.1 JC1.7
!C2
  Top 0.813: JC1.8 107.19,14.92 106.23,14.92 105.6,14.29 U$2.CJ1
!CPMA_DISABLE
  Top 0.813: JC1.17 78.61,14.92 77.66,14.92 77.03,14.29 U$2.CU1
!D
  Bottom 0.813: JD2.9 32.58,22.23 U$2.DK2
!DATA0  (via drill 0.81)
  Top 0.813: v237.68,50.48 238.95,50.48 241.81,53.34 E15.9 | v222.12,57.15 220.22,57.15 218.95,58.42 E14.4 | JA1.14 221.49,15.88 219.9,14.29 U$2.AR1
  Bottom 0.813: v237.68,50.48 235.46,48.26 235.46,34.61 228.16,27.3 222.12,27.3 | 222.12,27.3 221.81,27.3 221.81,18.1 JA1.14 | 222.12,27.3 v222.12,57.15
!DATA1  (via drill 0.81)
  Top 0.813: v218.31,45.4 227.52,45.4 227.52,53.66 225.93,55.24 E14.10 | JA1.15 218,15.56 216.72,14.29 U$2.AS1
  Bottom 0.813: E15.11 242.44,59.05 237.68,63.82 237.68,84.14 233.24,88.58 215.46,88.58 215.46,48.26 v218.31,45.4 218,45.09 218,24.13 218.63,23.5 218.63,18.1 JA1.15
!DATA2  (via drill 0.81)
  Top 0.813: v230.38,50.8 E15.7 | v230.38,63.5 E14.13 | v230.06,44.13 226.57,44.13 226.25,43.81 v212.6,43.81 | JA1.17 211.96,15.88 210.38,14.29 U$2.AU1
  Bottom 0.813: v230.38,63.5 v230.38,50.8 230.38,44.45 v230.06,44.13 | v212.6,43.81 212.6,23.81 212.28,23.5 212.28,20.95 211.96,20.64 JA1.17
!DATA3  (via drill 0.81)
  Top 0.813: v211.33,58.42 218.31,65.41 E14.1 | JA1.18 208.79,15.88 207.2,14.29 U$2.AV1
  Bottom 0.813: E15.5 234.82,56.52 236.41,58.1 236.41,83.5 232.6,87.31 218,87.31 218,66.36 E14.1 | v211.33,58.42 211.33,41.91 209.1,39.69 209.1,18.1 JA1.18
!DATA4  (via drill 0.81)
  Top 0.813: v125.92,49.53 v121.79,49.53 | v126.56,41.91 v138.94,41.91 v144.02,41.91 | v121.79,58.42 E8.4 | v138.94,53.34 E9.9 | v151.96,36.51 v144.02,36.51 | JB1.14 151.64,14.92 150.69,14.92 150.05,14.29 U$2.BR1
  Bottom 0.813: v121.79,49.53 v121.79,58.42 | v125.92,49.53 125.92,42.55 v126.56,41.91 | v138.94,41.91 v138.94,53.34 | v151.96,36.51 151.96,18.1 JB1.14 | v144.02,36.51 v144.02,41.91
!DATA5  (via drill 0.81)
  Top 0.813: v134.18,49.21 136.08,49.21 137.67,50.8 | 137.67,50.8 137.67,54.61 138.94,54.61 142.75,58.42 E9.11 | v143.38,48.26 140.53,48.26 137.99,50.8 137.67,50.8 | JB1.15 148.46,14.92 147.51,14.92 146.88,14.29 U$2.BS1
  Bottom 0.813: v134.18,49.21 127.51,55.88 E8.10 | v143.38,48.26 142.75,47.62 142.75,29.84 148.78,23.81 148.78,18.1 JB1.15
!DATA6  (via drill 0.81)
  Top 0.813: v129.09,60.64 126.87,62.87 E8.13 | JB1.17 142.11,14.92 141.16,14.92 140.53,14.29 U$2.BU1
  Bottom 0.813: v129.09,60.64 132.91,56.83 132.91,54.29 135.76,51.44 E9.7 135.76,50.16 135.44,49.85 135.44,26.35 136.08,25.72 137.99,25.72 137.99,27.62 138.62,28.26 142.43,28.26 142.43,18.1 JB1.17
!DATA7  (via drill 0.81)
  Top 0.813: v139.25,26.99 v136.72,26.99 120.84,26.99 v115.76,32.07 | E9.5 v137.67,55.88 | JB1.18 138.94,14.92 137.99,14.92 137.35,14.29 U$2.BV1
  Bottom 0.813: v139.25,26.99 139.25,18.1 JB1.18 | v136.72,26.99 136.72,47.31 137.67,48.26 v137.67,55.88 | v115.76,32.07 115.76,62.87 118.94,66.04 E8.1
!DATA8
  Top 0.813: E1.4 3.68,57.78 2.1,56.2 2.1,49.21 23.05,49.21 27.18,53.34 E2.9 | JD1.14 18.29,14.92 17.34,14.92 16.7,14.29 U$2.DR1
  Bottom 0.813: E2.9 27.81,52.7 18.61,43.5 18.61,18.1 JD1.14
!DATA9  (via drill 0.81)
  Top 0.813: v15.75,46.67 29.4,46.67 29.4,56.2 27.81,57.78 E2.11 | JD1.15 15.11,14.92 14.16,14.92 13.52,14.29 U$2.DS1
  Bottom 0.813: 15.43,46.67 15.43,18.1 JD1.15 | 15.43,46.67 15.43,51.75 E1.10 | 15.43,46.67 v15.75,46.67
!DATA10  (via drill 0.81)
  Top 0.813: v17.02,66.04 16.38,65.41 13.84,65.41 11.94,63.5 E1.13 | v17.02,31.43 9.08,23.5 9.08,18.1 JD1.17 8.76,14.92 7.81,14.92 7.18,14.29 U$2.DU1
  Bottom 0.813: v17.02,66.04 17.02,54.61 20.19,51.44 E2.7 20.19,50.16 17.02,46.99 v17.02,31.43
!DATA11  (via drill 0.81)
  Top 0.813: v14.16,50.48 19.56,55.88 E2.5 | JD1.18 5.59,14.92 4.64,14.92 4,14.29 U$2.DV1
  Bottom 0.813: v14.16,50.48 11.62,47.94 11.62,32.38 | 11.62,32.38 11.62,29.21 5.91,23.5 5.91,18.1 JD1.18 | E1.1 3.68,65.41 2.1,63.82 2.1,41.59 11.3,32.38 11.62,32.38
!E
  Bottom 0.813: JD2.10 29.4,22.23 U$2.DL2
!EMA0
  Bottom 0.813: JA2.4 251.65,22.23 U$2.AD2
!EMA1
  Bottom 0.813: JA2.5 248.47,22.23 U$2.AE2
!EMA2
  Bottom 0.813: JA2.7 242.12,22.23 U$2.AH2
!F
  Bottom 0.813: JD2.8 35.75,22.23 U$2.DJ2
!FSET
  Bottom 0.813: JD2.13 19.88,22.23 U$2.DP2
!IND1
  Bottom 0.813: JC2.17 77.03,22.23 U$2.CU2
!IND2
  Bottom 0.813: JC2.18 73.85,22.23 U$2.CV2
!INT_RQST  (via drill 0.81)
  Top 0.813: v96.08,62.23 98.3,62.23 102.11,66.04 E7.1 | JC1.13 91.31,14.92 90.36,14.92 89.73,14.29 U$2.CP1
  Bottom 0.813: v96.08,62.23 95.44,61.59 95.44,27.3 91.63,23.5 91.63,18.1 JC1.13
!INTERNAL_IO  (via drill 0.81)
  Top 0.813: v101.47,49.53 100.84,49.53 94.49,55.88 E6.10 | JC1.10 100.84,14.92 99.89,14.92 99.25,14.29 U$2.CL1
  Bottom 0.813: v101.47,49.53 101.47,23.81 101.16,23.5 101.16,18.1 JC1.10
!IO_PAUSE  (via drill 0.81)
  Top 0.813: v190.06,26.99 167.19,26.99 165.93,25.72 145.92,25.72 144.65,26.99 141.16,26.99 139.89,28.26 v134.18,28.26 | v133.86,20.64 133.86,20.32 120.84,20.32 120.52,20 v119.89,20 JC1.4 119.89,14.92 118.94,14.92 118.3,14.29 U$2.CD1 | v190.06,53.34 E12.9
  Bottom 0.813: E12.9 E12.10 | v190.06,26.99 v190.06,53.34 | v134.18,28.26 134.18,20.95 v133.86,20.64
!IR0
  Bottom 0.813: JD2.4 48.45,22.23 U$2.DD2
!IR1
  Bottom 0.813: JD2.5 45.28,22.23 U$2.DE2
!IR2
  Bottom 0.813: JD2.7 38.93,22.23 U$2.DH2
!KEY_CONT
  Bottom 0.813: JD2.17 7.49,18.73 7.18,18.41 U$2.DU2
!LA_ENABLE
  Bottom 0.813: JB2.11 159.57,22.23 U$2.BM2
!LINK
  Bottom 0.813: JA2.18 207.2,22.23 U$2.AV2
!LINK_DATA
  Bottom 0.813: JC2.14 86.55,22.23 U$2.CR2
!LINK_LOAD
  Bottom 0.813: JC2.15 83.38,22.23 U$2.CS2
!LOAD_CONT
  Bottom 0.813: JB2.7 172.28,22.23 U$2.BH2
!MA00
  Top 0.813: JA1.4 253.24,15.88 251.65,14.29 U$2.AD1
!MA01
  Top 0.813: JA1.5 250.06,15.88 248.47,14.29 U$2.AE1
!MA02
  Top 0.813: JA1.7 243.71,15.88 242.12,14.29 U$2.AH1
!MA03
  Top 0.813: JA1.8 240.54,15.88 238.95,14.29 U$2.AJ1
!MA04
  Top 0.813: JB1.4 183.39,14.92 182.44,14.92 181.8,14.29 U$2.BD1
!MA05
  Top 0.813: JB1.5 180.21,14.92 179.26,14.92 178.62,14.29 U$2.BE1
!MA06
  Top 0.813: JB1.7 173.86,14.92 172.91,14.92 172.28,14.29 U$2.BH1
!MA07
  Top 0.813: JB1.8 170.69,14.92 169.74,14.92 169.1,14.29 U$2.BJ1
!MA08
  Top 0.813: JD1.4 50.04,14.92 49.09,14.92 48.45,14.29 U$2.DD1
!MA09
  Top 0.813: JD1.5 46.86,14.92 45.91,14.92 45.28,14.29 U$2.DE1
!MA10
  Top 0.813: JD1.7 40.51,14.92 39.56,14.92 38.93,14.29 U$2.DH1
!MA11
  Top 0.813: JD1.8 37.34,14.92 36.39,14.92 35.75,14.29 U$2.DJ1
!MD00
  Top 0.813: JA1.9 237.36,15.88 235.78,14.29 U$2.AK1
!MD01
  Top 0.813: JA1.10 234.19,15.88 232.6,14.29 U$2.AL1
!MD02
  Top 0.813: JA1.11 231.01,15.88 229.43,14.29 U$2.AM1
!MD03  (via drill 0.81)
  Top 0.813: v191.32,70.17 201.8,70.17 202.44,70.8 v206.88,70.8 | v190.06,58.42 E12.4 | v216.41,26.04 v224.98,26.04 | v216.09,45.09 v206.56,45.09 | JA1.13 224.66,15.88 223.07,14.29 U$2.AP1
  Bottom 0.813: v190.06,58.42 190.06,64.45 191.32,65.72 v191.32,70.17 | !A3.1 v206.88,70.8 206.56,70.48 v206.56,45.09 | v224.98,26.04 224.98,22.23 224.66,21.91 JA1.13 | v216.41,26.04 216.41,39.37 216.09,39.69 v216.09,45.09
!MD04  (via drill 0.81)
  Top 0.813: v185.29,48.26 v191.32,48.26 194.18,48.26 194.5,47.94 v196.09,47.94 | v196.72,75.25 198.31,73.66 !A4.1 | v191.32,25.72 v167.83,25.72 | JB1.9 167.51,14.92 166.56,14.92 165.93,14.29 U$2.BK1
  Bottom 0.813: v196.09,47.94 196.09,72.71 196.41,73.03 196.41,74.93 v196.72,75.25 | v185.29,48.26 E12.7 | v167.83,25.72 167.83,18.1 JB1.9 | v191.32,48.26 v191.32,25.72
!MD05  (via drill 0.81)
  Top 0.813: v178.31,68.9 184.02,68.9 187.83,72.71 190.37,72.71 191.01,73.34 !A5.1 | JB1.10 164.34,14.92 163.38,14.92 162.75,14.29 U$2.BL1
  Bottom 0.813: v178.31,68.9 177.99,68.58 177.99,63.18 176.4,61.59 E11.12 171.96,60.96 171.96,44.45 166.56,39.05 166.56,25.4 164.66,23.5 164.66,18.1 JB1.10
!MD06  (via drill 0.81)
  Top 0.813: v179.58,71.44 181.48,73.34 183.39,73.34 !A6.1 | v164.02,46.99 170.37,46.99 170.37,51.44 173.55,54.61 174.5,54.61 175.77,55.88 E11.10 | JB1.11 161.16,14.92 160.21,14.92 159.57,14.29 U$2.BM1
  Bottom 0.813: v179.58,71.44 179.58,59.69 176.4,56.52 E11.10 | v164.02,46.99 163.07,46.04 163.07,25.08 161.48,23.5 161.48,18.1 JB1.11
!MD07  (via drill 0.81)
  Top 0.813: v170.69,68.9 175.13,73.34 175.77,73.34 !A7.1 | v165.29,52.07 166.88,52.07 168.15,53.34 E11.6 | JB1.13 154.81,14.92 153.86,14.92 153.22,14.29 U$2.BP1
  Bottom 0.813: v170.69,68.9 170.69,55.88 168.78,53.98 E11.6 | v165.29,52.07 161.8,48.58 161.8,30.16 155.13,23.5 155.13,18.1 JB1.13
!MD08  (via drill 0.81)
  Top 0.813: v47.82,73.98 49.4,73.98 57.02,81.6 97.98,81.6 97.98,73.66 102.43,69.22 111.31,69.22 119.89,77.79 164.34,77.79 168.15,73.98 !A8.1 | JD1.9 34.16,14.92 33.21,14.92 32.58,14.29 U$2.DK1
  Bottom 0.813: E11.4 168.78,59.05 167.19,60.64 167.19,71.75 168.47,73.03 !A8.1 | v47.82,73.98 47.18,73.34 47.18,36.2 34.48,23.5 34.48,18.1 JD1.9
!MD09  (via drill 0.81)
  Top 0.813: v31.31,34.61 v63.05,34.61 | v63.05,58.42 E4.11 | JD1.10 30.99,14.92 30.04,14.92 29.4,14.29 U$2.DL1
  Bottom 0.813: v63.05,34.61 v63.05,58.42 | v31.31,34.61 31.31,18.1 JD1.10
!MD10  (via drill 0.81)
  Top 0.813: v37.65,20 37.02,19.37 29.72,19.37 28.45,18.1 28.13,18.1 JD1.11 27.81,14.92 26.86,14.92 26.23,14.29 U$2.DM1
  Bottom 0.813: v37.65,20 37.65,23.5 51.62,37.47 51.62,48.58 53.21,50.16 E4.7
!MD11  (via drill 0.81)
  Top 0.813: v57.34,52.7 57.97,53.34 E4.9 | v21.78,33.34 v57.34,33.34 | JD1.13 21.46,14.92 20.51,14.92 19.88,14.29 U$2.DP1
  Bottom 0.813: v57.34,33.34 v57.34,52.7 | v21.78,33.34 21.78,20.95 21.46,20.64 JD1.13
!MD_DIR
  Bottom 0.813: JA2.9 235.78,22.23 U$2.AK2
!MEM_START
  Bottom 0.813: JA2.8 238.95,22.23 U$2.AJ2
!MS_DISABLE
  Top 0.813: JC1.18 75.44,14.92 74.48,14.92 73.85,14.29 U$2.CV1
!NOT_LAST_TR
  Top 0.813: JC1.11 97.66,14.92 96.71,14.92 96.08,14.29 U$2.CM1
!NTS_STALL
  Bottom 0.813: JB2.14 150.05,22.23 U$2.BR2
!OVERFLOW
  Bottom 0.813: JB2.8 169.1,22.23 U$2.BJ2
!ROM_ADDR
  Bottom 0.813: JA2.17 210.38,22.23 U$2.AU2
!RUN
  Bottom 0.813: JB2.17 140.53,22.23 U$2.BU2
!SKIP  (via drill 0.81)
  Top 0.813: v85.28,25.72 v100.2,25.72 | JC1.15 84.96,14.92 84.01,14.92 83.38,14.29 U$2.CS1
  Bottom 0.813: v100.2,25.72 100.2,55.24 101.16,56.2 101.16,57.47 102.11,58.42 E7.4 | v85.28,25.72 85.28,18.1 JC1.15
!STOP
  Bottom 0.813: JD2.15 13.52,22.23 U$2.DS2
!TS1
  Bottom 0.813: JC2.9 102.43,22.23 U$2.CK2
!TS2
  Bottom 0.813: JC2.10 99.25,22.23 U$2.CL2
!TS3
  Bottom 0.813: JC2.11 96.08,22.23 U$2.CM2
!TS4
  Bottom 0.813: JC2.13 89.73,22.23 U$2.CP2
!USER_MODE
  Bottom 0.813: JD2.11 26.23,22.23 U$2.DM2
+15V
  Bottom 0.813: JD2.1 57.97,22.23 U$2.DA2
-15V
  Top 0.813: 123.06,24.45 57.02,24.45 55.75,23.18 JD2.2 | 123.06,24.45 124.33,23.18 JC2.2 | 123.06,24.45 186.56,24.45 187.83,23.18 JB2.2 189.1,22.54 190.37,21.27 256.41,21.27 257.68,22.54 JA2.2
  Bottom 0.813: JA2.2 258,22.23 U$2.AB2 | JB2.2 188.15,22.23 U$2.BB2 | JD2.2 54.8,22.23 U$2.DB2 | JC2.2 124.65,22.23 U$2.CB2
BTP3
  Bottom 0.813: E6.13 93.85,64.14 95.44,65.72 95.44,73.03 94.17,74.3 3.1
C0
  Bottom 0.813: E7.11 110.36,59.05 108.78,60.64 108.78,72.39 109.41,73.03 109.41,74.3 108.14,75.56 C0.1
C1
  Bottom 0.813: E7.8 110.36,51.44 113.22,54.29 113.22,74.3 111.95,75.56 C1.1
D0
  Top 0.813: E16.12 258.95,56.52 260.54,58.1 260.54,74.61 246.89,74.61 245.62,75.88 D0.1
D1
  Bottom 0.813: E16.10 258.95,51.44 254.51,55.88 254.51,76.52 253.24,77.79 249.11,77.79 249.11,76.83 D1.1
D2  (via drill 0.81)
  Top 0.813: v253.24,67.63 254.19,67.63 258.32,63.5 E16.15
  Bottom 0.813: v253.24,67.63 252.92,67.94 252.92,75.56 D2.1
D3
  Bottom 0.813: E16.13 258.95,59.05 257.05,60.96 257.05,75.88 D3.1
D4  (via drill 0.81)
  Top 0.813: v161.48,68.9 155.77,74.61 147.83,74.61 146.56,75.88 D4.1
  Bottom 0.813: v161.48,68.9 161.48,58.1 159.89,56.52 E10.12
D5
  Bottom 0.813: E10.10 159.89,50.16 155.13,45.4 155.13,40.32 153.86,39.05 150.37,39.05 150.37,75.88 D5.1
D6  (via drill 0.81)
  Top 0.813: v156.4,66.36 159.26,63.5 E10.15
  Bottom 0.813: v156.4,66.36 155.13,67.63 155.13,74.3 153.86,75.56 D6.1
D7
  Bottom 0.813: E10.13 159.89,59.05 157.67,61.28 157.67,75.56 D7.1
D8  (via drill 0.81)
  Top 0.813: v39.56,70.17 35.11,74.61 32.26,74.61 30.99,75.88 D8.1
  Bottom 0.813: v39.56,70.17 39.56,61.28 44.32,56.52 E3.12
D9
  Bottom 0.813: E3.10 44.32,51.44 45.91,53.02 45.91,74.3 47.18,75.56 47.18,76.83 44.96,79.06 34.48,79.06 34.48,76.83 D9.1
D10
  Bottom 0.813: E3.15 44.32,64.14 42.73,65.72 42.73,74.93 43.37,75.56 43.37,76.83 42.42,77.79 38.29,77.79 38.29,76.83 D10.1
D11
  Bottom 0.813: E3.13 44.32,59.05 41.47,61.91 41.47,75.56 D11.1
GND  (via drill 0.81)
  Top 0.813: JC2.12 92.58,22.54 91.31,21.27 85.6,21.27 82.42,18.1 82.11,18.1 JC1.16 80.2,17.78 U$2.CT2 | 115.28,19.21 117.35,21.27 119.89,21.27 121.16,22.54 JC2.3 | 115.28,19.21 114.17,18.1 113.86,18.1 JC1.6 | 111.95,19.37 96.39,19.37 95.12,18.1 94.81,18.1 94.81,17.78 JC1.12 92.9,17.78 U$2.CN2 | 111.95,19.37 115.12,19.37 115.28,19.21 | JD2.12 22.73,22.54 19.56,19.37 13.84,19.37 12.57,18.1 12.26,18.1 JD1.16 10.35,17.78 U$2.DT2 | 50.2,21.43 48.13,19.37 45.59,19.37 44.32,18.1 44.01,18.1 JD1.6 42.1,17.78 U$2.DF2 | 50.2,21.43 51.31,22.54 JD2.3 | 38.29,63.5 41.15,63.5 43.69,60.96 E3.14 47.5,60.96 52.58,66.04 E4.1 | 38.29,63.5 E3.2 36.07,63.5 31.94,67.63 22.42,67.63 20.83,66.04 E2.1 | 39.88,53.34 37.34,55.88 | 37.34,55.88 E3.5 | 39.88,53.34 E3.11 | 39.88,53.34 39.88,48.9 36.7,48.9 E3.8 | 38.29,63.5 38.29,56.2 37.34,56.2 37.34,55.88 | JC2.16 79.88,22.54 78.61,21.27 50.36,21.27 50.2,21.43 | E11.1 168.15,66.04 163.07,60.96 E10.14 155.45,60.96 | JB2.12 156.08,22.54 154.81,21.27 149.1,21.27 145.92,18.1 145.6,18.1 JB1.16 143.7,17.78 U$2.BT2 | 178.94,19.37 181.48,19.37 184.66,22.54 JB2.3 | 178.94,19.37 177.67,18.1 177.35,18.1 JB1.6 | 178.94,19.37 175.45,19.37 | 175.45,19.37 159.89,19.37 158.62,18.1 158.31,18.1 JB1.12 156.4,17.78 U$2.BN2 | 254.51,60.96 251.97,63.5 E16.2 | 254.51,60.96 E16.14 | 257.52,54.13 255.78,55.88 254.51,55.88 | 257.52,54.13 258.32,53.34 E16.11 | 254.51,55.88 E16.5 | E16.8 257.05,53.98 257.37,53.98 257.52,54.13 | 254.51,55.88 254.51,60.96 | 226.41,18.89 227.2,18.1 227.52,18.1 JA1.12 227.84,18.1 228.47,18.1 229.74,19.37 244.98,19.37 245.46,18.89 | 226.41,18.89 225.93,19.37 217.04,19.37 215.77,18.1 215.46,18.1 JA1.16 213.55,16.19 U$2.AT2
  Top 0.813: 245.46,18.89 246.25,18.1 246.57,18.1 JA1.6 | v204.03,79.06 204.34,79.38 v213.55,79.38 213.87,79.06 227.84,79.06 v230.38,76.52 | 52.26,42.23 40.2,42.23 38.61,40.64 BYP11.2 | 52.26,42.23 53.85,40.64 BYP10.2 | BYP9.2 70.36,40.64 69.41,41.59 61.15,41.59 60.52,42.23 52.26,42.23 | JD2.6 41.78,22.54 40.51,21.27 28.45,21.27 25.27,18.1 24.96,18.1 JD1.12 23.05,17.78 U$2.DN2 | BYP1.2 251.33,43.18 247.21,39.05 221.81,39.05 220.22,40.64 BYP2.2 218.95,40.64 217.36,39.05 205.3,39.05 203.71,40.64 BYP3.2 202.44,40.64 202.12,40.96 v184.34,40.96 | 155.45,60.96 152.91,63.5 E10.2 | 158.78,53.82 156.72,55.88 155.45,55.88 | 158.78,53.82 159.26,53.34 E10.11 | 155.45,55.88 E10.5 | 155.45,55.88 155.45,60.96 | E10.8 152.91,48.26 158.31,53.66 158.62,53.66 158.78,53.82 | v180.85,60.96 185.29,65.41 E12.1 | BYP5.2 154.18,40.64 155.77,42.23 167.83,42.23 169.42,40.64 BYP4.2 | 101.79,39.05 89.73,39.05 88.14,40.64 BYP8.2 | 101.79,39.05 103.38,40.64 BYP7.2 | BYP6.2 119.89,40.64 118.3,39.05 101.79,39.05 | U$2.DC2 51.62,17.78 JD1.3 | 175.45,19.37 U$2.BF2 | U$2.BC1 184.97,17.78 JB1.3 | U$2.AN2 226.25,18.73 226.41,18.89 | U$2.AF2 245.3,18.73 245.46,18.89 | 111.95,19.37 U$2.CF2 | U$2.CC2 121.48,17.78 JC1.3 | U$2.AC1 254.82,17.78 JA1.3
  Bottom 0.813: JC2.16 80.84,22.23 81.47,21.59 81.47,18.1 JC1.16 81.79,17.46 80.84,16.51 80.84,8.57 U$2.CT2 | JC2.12 93.54,22.23 94.17,21.59 94.17,18.1 JC1.12 94.49,17.46 93.54,16.51 93.54,8.57 U$2.CN2 | JC2.6 112.59,22.23 113.22,21.59 113.22,18.1 JC1.6 113.54,17.46 111.95,15.88 U$2.CF2 | E8.7 119.25,42.55 120.52,41.27 BYP6.2 120.52,40.01 121.48,39.05 121.48,23.5 JC2.3 122.11,22.23 122.75,21.59 122.75,18.1 JC1.3 123.06,17.46 122.11,16.51 122.11,8.57 U$2.CC2 | JD2.12 23.69,22.23 24.32,21.59 24.32,18.1 JD1.12 24.64,17.46 23.69,16.51 23.69,8.57 U$2.DN2 | 10.99,19.05 11.62,18.41 11.62,18.1 JD1.16 | 10.99,19.05 10.99,22.23 JD2.16 | 52.74,21.75 52.26,22.23 JD2.3 | 52.74,21.75 52.9,21.59 52.9,18.1 JD1.3 53.21,17.46 52.26,16.51 52.26,8.57 U$2.DC2 | JD2.6 42.73,22.23 43.37,21.59 43.37,18.1 JD1.6 43.69,17.46 42.73,16.51 42.73,8.57 U$2.DF2 | E5.8 69.72,47.62 70.99,46.35 BYP9.2 | BYP5.2 153.54,41.27 152.27,42.55 E10.8 | BYP8.2 87.5,41.27 86.23,42.55 E6.7 | BYP7.2 104.01,41.27 102.74,42.55 E7.7 102.74,51.44 105.6,54.29 105.6,76.83 104.65,77.79 96.71,77.79 96.71,76.83 G.1 95.76,76.52 79.88,92.39 SV177.12 | 144.34,83.5 144.34,74.61 E9.1 | 144.34,83.5 144.34,88.27 148.46,92.39 SV302.12 | JB2.16 144.34,22.23 144.97,21.59 144.97,18.1 JB1.16 145.29,17.46 144.34,16.51 144.34,8.57 U$2.BT2 | JB2.12 157.03,22.23 157.67,21.59 157.67,18.1 JB1.12 157.99,17.46 157.03,16.51 157.03,8.57 U$2.BN2 | JB2.3 185.61,22.23 186.25,21.59 186.25,18.1 JB1.3 186.56,17.46 185.61,16.51 185.61,8.57 U$2.BC1 | 176.09,19.05 176.72,18.41 176.72,18.1 JB1.6 | 176.09,19.05 176.09,22.23 JB2.6 175.45,23.5 175.45,34.61 173.39,36.67
  Bottom 0.813: JA2.16 214.19,22.23 214.82,21.59 214.82,18.1 JA1.16 215.14,17.46 214.19,16.51 214.19,8.57 U$2.AT2 | JA2.12 226.88,22.23 227.52,21.59 227.52,18.1 JA1.12 227.84,17.46 226.88,16.51 226.88,8.57 U$2.AN2 | 245.94,19.05 246.57,18.41 246.57,18.1 JA1.6 | 245.94,19.05 245.94,22.23 JA2.6 246.89,24.45 254.82,24.45 | SV9.12 6.22,92.39 4.64,90.81 4.64,75.56 5.27,74.93 5.27,53.02 3.68,51.44 E1.7 3.68,42.55 4.95,41.27 BYP12.2 | v204.03,79.06 204.03,68.9 201.8,66.67 E13.1 | v213.55,79.38 213.55,88.58 218,92.71 219.58,92.71 SV314.12 | BYP11.2 37.97,41.27 36.7,42.55 E3.8 | BYP10.2 54.48,40.01 52.9,38.42 52.9,21.91 52.74,21.75 | E14.7 218.31,50.16 219.58,48.9 BYP2.2 | E16.8 251.33,45.09 252.6,43.81 BYP1.2 252.6,42.55 254.82,40.32 254.82,24.45 | 254.82,24.45 254.82,23.5 JA2.3 255.46,22.23 256.1,21.59 256.1,18.1 JA1.3 256.41,17.46 255.46,16.51 255.46,8.57 U$2.AC1 | 173.39,36.67 170.05,40.01 BYP4.2 | 180.85,44.13 v180.85,60.96 | 180.85,44.13 173.55,36.83 173.39,36.67 | v230.38,76.52 230.38,71.12 234.82,66.67 E15.1 | E10.2 152.27,64.14 153.86,65.72 153.86,73.66 151.64,75.88 151.64,76.52 144.65,83.5 144.34,83.5 | v184.34,40.96 181.16,44.13 180.85,44.13 | U$2.DT2 10.99,8.57 10.99,19.05 | U$2.BF2 176.09,8.57 176.09,19.05 | U$2.AF2 245.94,8.57 245.94,19.05
  pour Bottom (no thermals): 2.41,187.96 260.22,187.96 260.22,180.34 8.76,180.34 8.76,177.8 6.22,177.8 6.22,180.34 2.41,180.34
  pour Bottom (isolate 0.406, no thermals): 6.22,180.34 8.76,180.34 8.76,92.71 6.22,92.71
  pour Bottom (no thermals): 41.78,180.34 44.32,180.34 44.32,92.71 41.78,92.71
  pour Bottom (no thermals): 77.34,180.34 79.88,180.34 79.88,92.71 77.34,92.71
  pour Bottom (no thermals): 112.9,180.34 115.44,180.34 115.44,92.71 112.9,92.71
  pour Bottom (no thermals): 148.46,180.34 151,180.34 151,92.71 148.46,92.71
  pour Bottom (no thermals): 184.02,180.34 186.56,180.34 186.56,92.71 184.02,92.71
  pour Bottom (no thermals): 219.58,180.34 222.12,180.34 222.12,92.71 219.58,92.71
  pour Bottom (no thermals): 255.14,180.34 257.68,180.34 257.68,92.71 255.14,92.71
  pour Top (isolate 0.406, no thermals): 6.22,92.71 8.76,92.71 8.76,179.07 6.22,179.07
  pour Top (isolate 0.406, no thermals): 41.78,92.71 44.32,92.71 44.32,179.07 41.78,179.07
  pour Top (isolate 0.406, no thermals): 77.34,92.71 79.88,92.71 79.88,179.07 77.34,179.07
  pour Top (isolate 0.406, no thermals): 112.9,92.71 115.44,92.71 115.44,179.07 112.9,179.07
  pour Top (isolate 0.406, no thermals): 148.46,92.71 151,92.71 151,179.07 148.46,179.07
  pour Top (isolate 0.406, no thermals): 184.02,92.71 186.56,92.71 186.56,179.07 184.02,179.07
  pour Top (isolate 0.406, no thermals): 219.58,92.71 222.12,92.71 222.12,179.07 219.58,179.07
  pour Top (isolate 0.406, no thermals): 255.14,92.71 257.68,92.71 257.68,179.07 255.14,179.07
I
  Bottom 0.813: E7.2 102.74,64.14 101.16,65.72 101.16,72.39 102.43,73.66 102.43,74.3 103.7,75.56 I.1
I0
  Bottom 0.813: E14.6 218.31,53.98 220.85,56.52 220.85,64.77 221.17,65.09 221.17,75.56 I0.1
I1  (via drill 0.81)
  Top 0.813: v227.52,73.03 224.98,75.56 I1.1
  Bottom 0.813: v227.52,73.03 227.52,53.02 225.93,51.44 E14.8
I2
  Bottom 0.813: E14.12 225.93,61.59 223.07,64.45 223.07,82.23 225.62,84.77 228.16,84.77 228.16,76.83 I2.1
I3
  Bottom 0.813: E14.2 218.31,64.14 219.9,65.72 219.9,74.93 219.27,75.56 219.27,80.33 224.98,86.04 231.97,86.04 231.97,76.83 I3.1
I4  (via drill 0.81)
  Top 0.813: v123.06,54.61 121.16,54.61 119.89,53.34 E8.6
  Bottom 0.813: v123.06,54.61 123.06,74.61 122.11,75.56 I4.1
I5  (via drill 0.81)
  Top 0.813: v130.37,66.67 130.37,54.93 126.87,51.44 E8.8
  Bottom 0.813: v130.37,66.67 131,67.31 131,76.83 130.05,77.79 125.92,77.79 125.92,76.83 I5.1
I6
  Bottom 0.813: E8.12 126.87,61.59 129.09,63.82 129.09,75.56 I6.1
I7  (via drill 0.81)
  Top 0.813: v121.79,69.22 127.19,74.61 131.32,74.61 132.59,75.88 I7.1
  Bottom 0.813: v121.79,69.22 121.79,66.67 119.25,64.14 E8.2
I8  (via drill 0.81)
  Top 0.813: v6.54,56.83 3.68,53.98 E1.6
  Bottom 0.813: v6.54,56.83 6.54,75.56 I8.1
I9
  Top 0.813: E1.8 11.3,51.44 14.48,54.61 14.48,64.14 17.02,64.14 18.61,65.72 18.61,74.93 19.24,75.56 19.24,77.79 11.94,77.79 10.67,76.52 I9.1
I10
  Bottom 0.813: E1.12 11.3,61.59 13.52,63.82 13.52,75.56 I10.1
I11
  Top 0.813: E1.2 3.68,64.14 2.1,65.72 2.1,74.61 15.75,74.61 17.02,75.88 I11.1
INHIBIT
  Bottom 0.813: JA2.13 223.07,22.23 U$2.AP2
INITIALIZE
  Top 0.813: JC1.14 88.14,14.92 87.19,14.92 86.55,14.29 U$2.CR1
INT_IN_PROG
  Bottom 0.813: JB2.13 153.22,22.23 U$2.BP2
INT_STROBE
  Bottom 0.813: JB2.4 181.8,22.23 U$2.BD2
N$1  (via drill 0.81)
  Top 0.813: 6.06,58.26 6.22,58.42 E1.11 | 6.06,58.26 E1.5 | E1.3 3.68,60.33 5.59,58.42 5.91,58.42 6.06,58.26 | 124.17,55.4 123.7,55.88 E8.5 | 124.17,55.4 126.24,53.34 E8.9 | E8.11 126.87,57.78 124.65,55.56 124.33,55.56 124.17,55.4 | 223.23,55.4 222.76,55.88 E14.5 | 223.23,55.4 225.3,53.34 E14.9 | E14.11 225.93,57.78 223.71,55.56 223.39,55.56 223.23,55.4 | R1.1 248.16,30.48 243.4,35.24 v234.19,35.24 231.65,32.7 134.81,32.7 v134.18,33.34 v92.9,33.34
  Bottom 0.813: 9.71,56.2 9.71,55.56 11.3,53.98 E1.9 | 9.71,56.2 11.3,57.78 E1.11 | 9.71,56.2 9.71,66.36 11.62,68.26 11.62,81.6 79.25,81.6 84.01,76.83 84.01,68.9 86.23,66.67 E6.1 86.23,65.41 84.65,63.82 84.65,41.59 v92.9,33.34 | E8.3 119.25,60.33 117.67,58.74 117.67,58.1 119.25,56.52 E8.5 | E14.3 218.31,60.33 216.72,58.74 216.72,58.1 218.31,56.52 E14.5 | v234.19,35.24 224.34,45.09 224.34,51.75 E14.9 | v134.18,33.34 134.18,45.4 126.87,52.7 E8.9
N$18  (via drill 0.81)
  Top 0.813: v65.59,38.42 v73.53,38.42 | v65.59,68.9 v59.88,68.9 | v73.53,58.42 E5.13
  Bottom 0.813: v73.53,38.42 v73.53,58.42 | v65.59,38.42 v65.59,68.9 | v59.88,68.9 59.88,74.61 59.56,74.93 F0.1
N$19  (via drill 0.81)
  Top 0.813: v77.98,79.06 66.55,79.06 64.01,76.52 F1.1
  Bottom 0.813: v77.98,79.06 80.2,76.83 80.2,76.2 81.15,75.25 81.15,60.33 77.34,56.52 E5.12
N$20  (via drill 0.81)
  Top 0.813: v66.87,42.86 v74.8,42.86 | v74.8,53.34 E5.11
  Bottom 0.813: v74.8,42.86 v74.8,53.34 | v66.87,42.86 66.87,72.71 67.18,73.03 F2.1
N$21  (via drill 0.81)
  Top 0.813: v82.42,73.98 84.01,75.56 84.01,77.79 72.9,77.79 71.63,76.52 F3.1
  Bottom 0.813: v82.42,73.98 82.42,55.88 E5.10
N$22
  Bottom 0.813: E5.9 77.34,47.62 77.66,47.31 77.66,40.32 70.68,33.34 64.33,33.34 64.33,74.93 65.59,76.2 65.59,76.83 66.55,77.79 74.48,77.79 74.48,76.83 F4.1
N$23  (via drill 0.81)
  Top 0.813: E5.3 v75.12,66.36
  Bottom 0.813: v75.12,66.36 78.3,69.53 78.3,75.56 F5.1
N$24  (via drill 0.81)
  Top 0.813: v71.31,72.71 80.52,72.71 81.15,73.34 81.15,75.88 81.79,75.88 F6.1
  Bottom 0.813: v71.31,72.71 71.31,60.64 69.72,59.05 E5.4
N$25  (via drill 0.81)
  Top 0.813: v68.14,68.9 79.25,68.9 85.92,75.56 F7.1
  Bottom 0.813: v68.14,68.9 68.14,58.1 69.72,56.52 E5.5
N$26
  Top 0.813: SV149.1 154.18,174.94 155.45,174.94 SV149.3 156.72,174.94 157.99,174.94 SV149.5 159.26,174.94 160.53,174.94 SV149.7 161.8,174.94 163.07,174.94 SV149.9
  Bottom 0.813: SV149.1 SV149.9
N$27
  Top 0.813: SV149.2 154.18,177.48 155.45,177.48 SV149.4 156.72,177.48 157.99,177.48 SV149.6 159.26,177.48 160.53,177.48 SV149.8 161.8,177.48 163.07,177.48 SV149.10
  Bottom 0.813: SV149.10 SV149.2
N$28
  Top 0.813: SV150.1 171.96,174.94 173.23,174.94 SV150.3 174.5,174.94 175.77,174.94 SV150.5 177.04,174.94 178.31,174.94 SV150.7 179.58,174.94 180.85,174.94 SV150.9
  Bottom 0.813: SV150.1 SV150.9
N$29
  Top 0.813: SV150.2 171.96,177.48 173.23,177.48 SV150.4 174.5,177.48 175.77,177.48 SV150.6 177.04,177.48 178.31,177.48 SV150.8 179.58,177.48 180.85,177.48 SV150.10
  Bottom 0.813: SV150.10 SV150.2
N$30
  Top 0.813: SV153.1 154.18,129.22 155.45,129.22 SV153.3 156.72,129.22 157.99,129.22 SV153.5 159.26,129.22 160.53,129.22 SV153.7 161.8,129.22 163.07,129.22 SV153.9
  Bottom 0.813: SV153.1 SV153.9
N$31
  Top 0.813: SV153.2 154.18,131.76 155.45,131.76 SV153.4 156.72,131.76 157.99,131.76 SV153.6 159.26,131.76 160.53,131.76 SV153.8 161.8,131.76 163.07,131.76 SV153.10
  Bottom 0.813: SV153.2 SV153.10
N$32
  Top 0.813: SV154.1 171.96,129.22 173.23,129.22 SV154.3 174.5,129.22 175.77,129.22 SV154.5 177.04,129.22 178.31,129.22 SV154.7 179.58,129.22 180.85,129.22 SV154.9
  Bottom 0.813: SV154.1 SV154.9
N$33
  Top 0.813: SV154.2 171.96,131.76 173.23,131.76 SV154.4 174.5,131.76 175.77,131.76 SV154.6 177.04,131.76 178.31,131.76 SV154.8 179.58,131.76 180.85,131.76 SV154.10
  Bottom 0.813: SV154.2 SV154.10
N$34
  Top 0.813: SV155.1 189.74,169.86 191.01,169.86 SV155.3 192.28,169.86 193.55,169.86 SV155.5 194.82,169.86 196.09,169.86 SV155.7 197.36,169.86 198.63,169.86 SV155.9
  Bottom 0.813: SV155.9 SV155.1
N$35
  Top 0.813: SV155.2 189.74,172.4 191.01,172.4 SV155.4 192.28,172.4 193.55,172.4 SV155.6 194.82,172.4 196.09,172.4 SV155.8 197.36,172.4 198.63,172.4 SV155.10
  Bottom 0.813: SV155.2 SV155.10
N$36